# EasyEDA Pro project GD32.eprj

# Schematic GD32
Create Date: 2024-03-06; Page Name: GD32; Project Name: GD32; Schematic Name: STM32小项目; Update Date: 2024-03-07; Company: 清华大学; Drawed: 李家瑶; Page Size: A4; Reviewed: 李家瑶; Version: V1.0
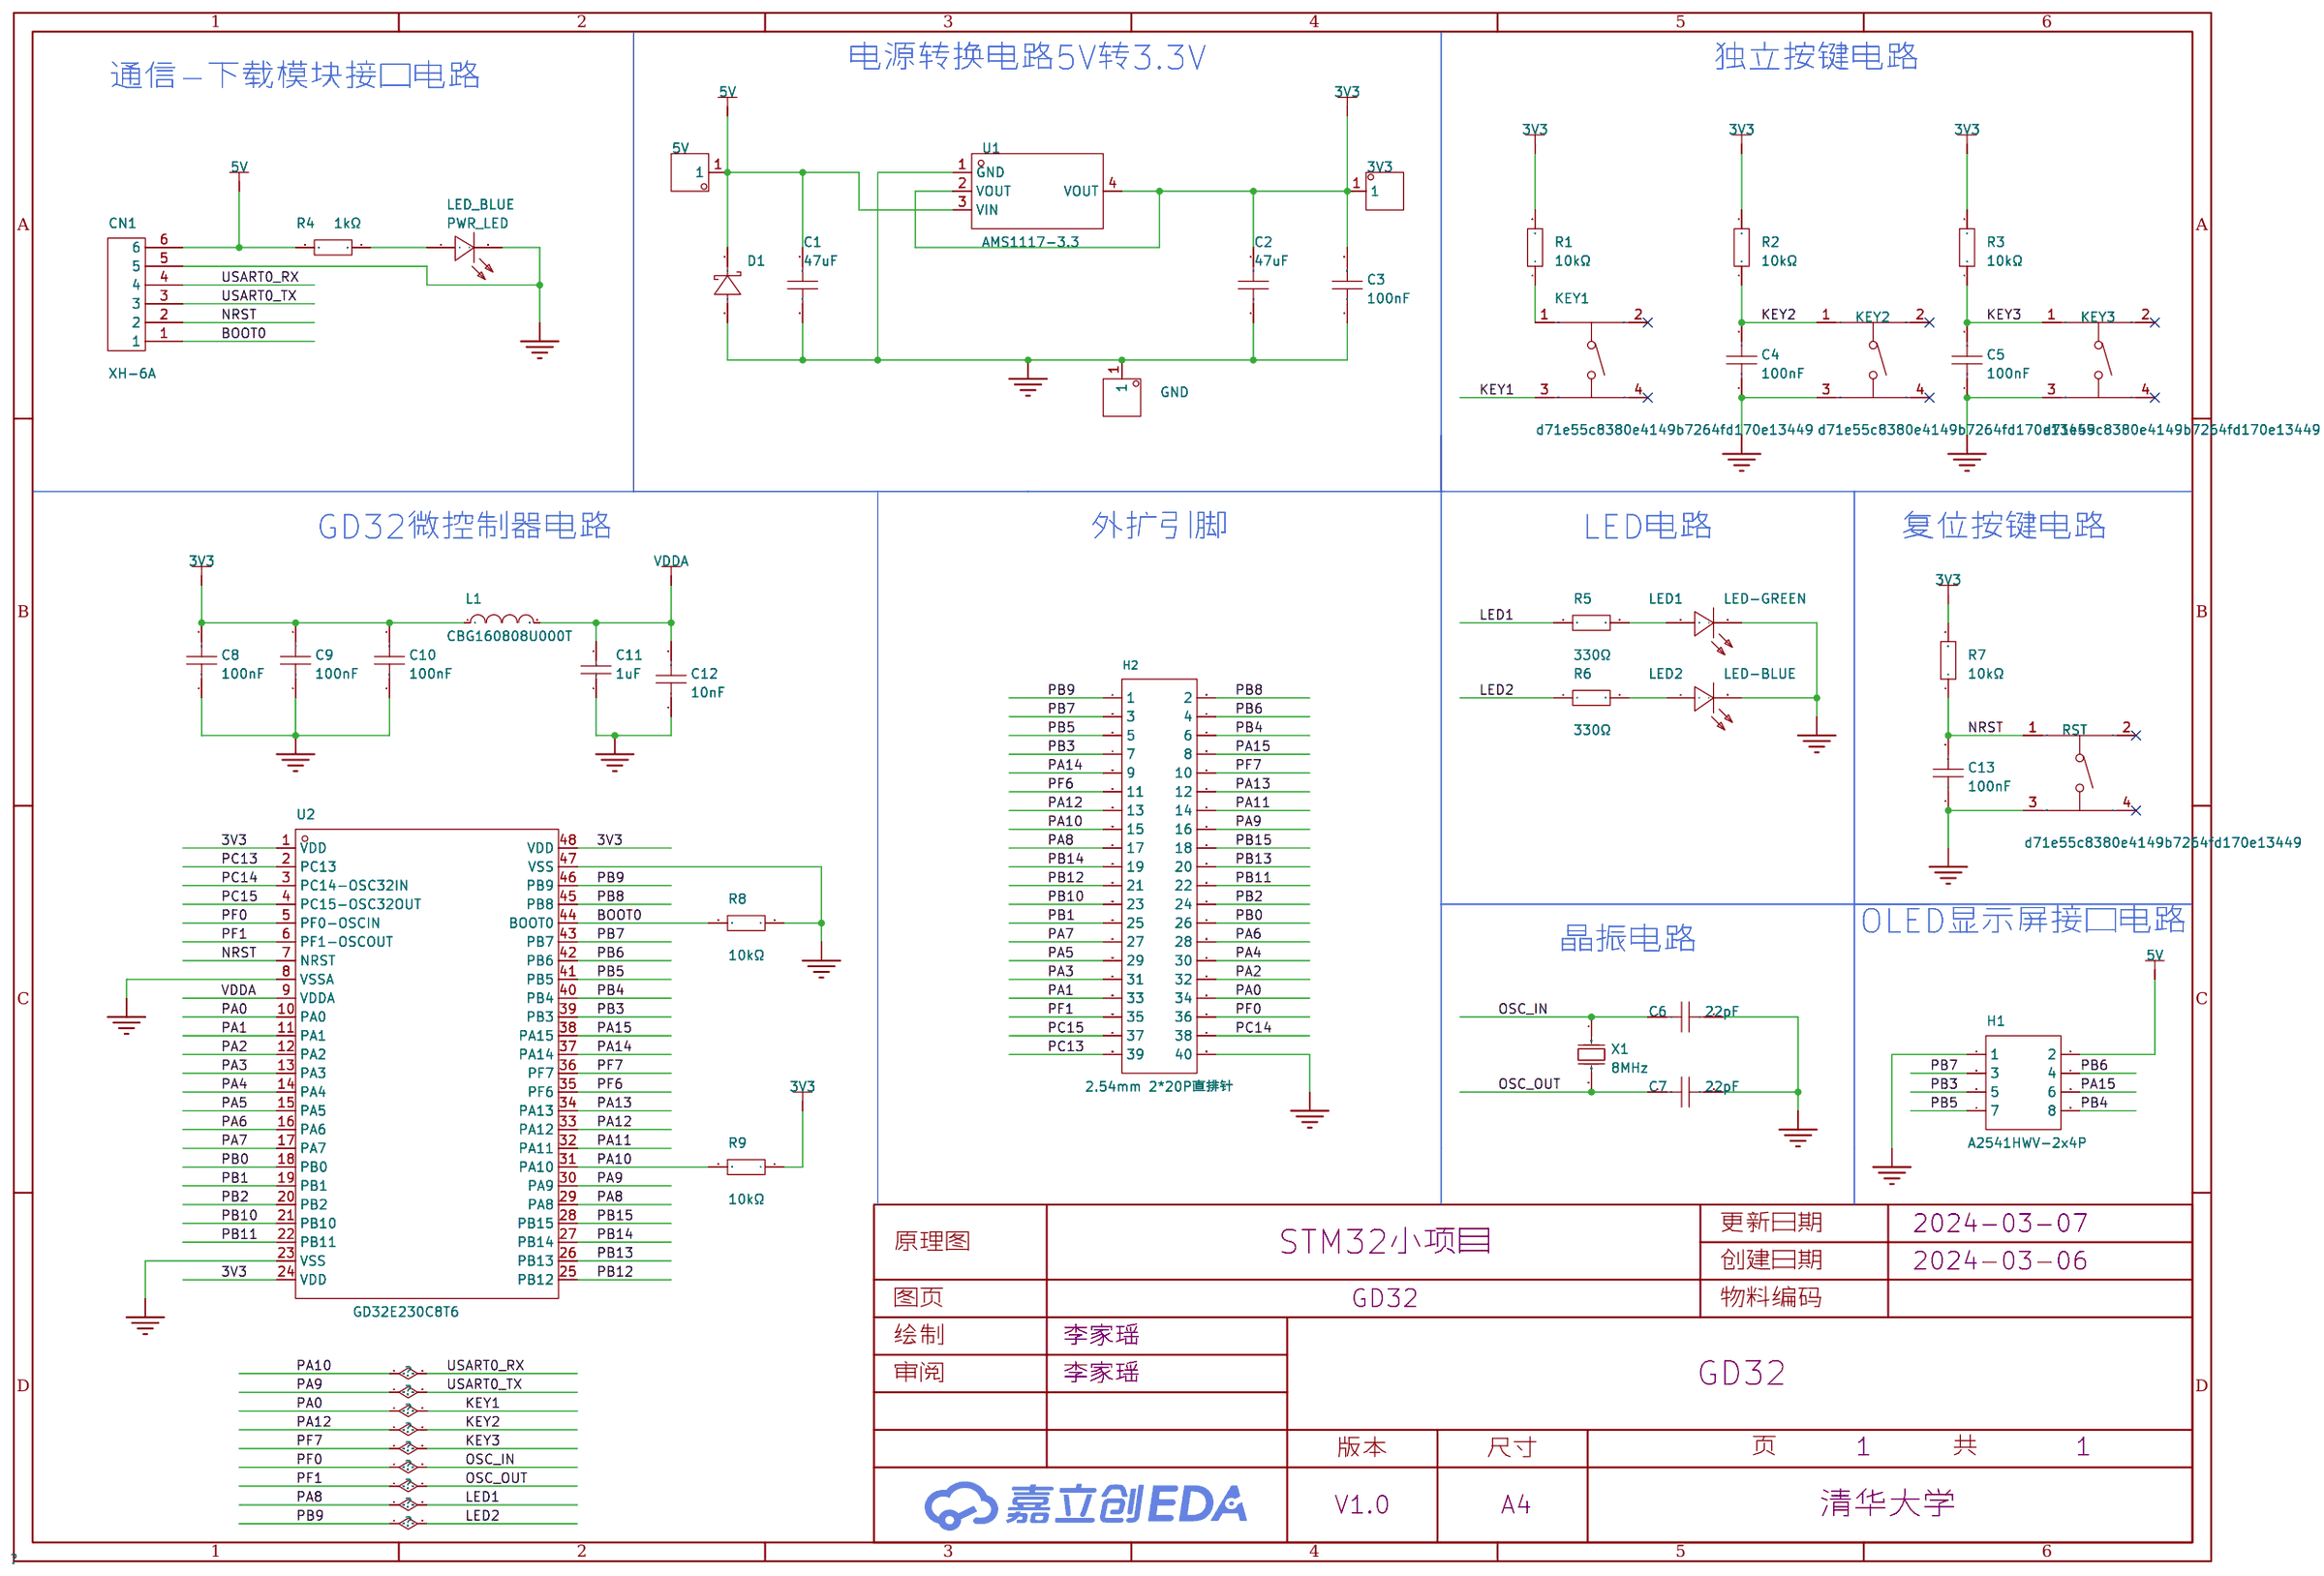
[diagram p0: schematic sheet]

## Parts
3V3  5003  [TEST-TH_BD2.54-P1.39]
5V  5003  [TEST-TH_BD2.54-P1.39]
C1  47uF  [C1206]
C2  47uF  [C1206]
C3  100nF  [C0603]
C4  100nF  [C0603]
C5  100nF  [C0603]
C6  22pF  [C0603]
C7  22pF  [C0603]
C8  100nF  [C0603]
C9  100nF  [C0603]
C10  100nF  [C0603]
C11  1uF  [C0603]
C12  10nF  [C0603]
C13  100nF  [C0603]
CN1  XH-6A  [CONN-TH_6P-P2.50_XH-6A]
D1  SMAJ5.0A  [SMA_L4.3-W2.6-LS5.0-RD]
GND  5003  [TEST-TH_BD2.54-P1.39]
H1  A2541HWV-2x4P  [HDR-TH_8P-P2.54-V-F-R2-C4-S2.54-1]
H2  2.54mm 2*20P直排针  [HDR-TH_40P-P2.54-V-M-R2-C20-S2.54]
KEY1  d71e55c8380e4149b7264fd170e13449  [SW-TH_4P-L6.0-W6.0-P4.50-LS6.5]
KEY2  d71e55c8380e4149b7264fd170e13449  [SW-TH_4P-L6.0-W6.0-P4.50-LS6.5]
KEY3  d71e55c8380e4149b7264fd170e13449  [SW-TH_4P-L6.0-W6.0-P4.50-LS6.5]
L1  CBG160808U000T  [L0603]
LED1  LED-GREEN  [LED0805-R-RD]
LED2  LED-BLUE  [LED0805-R-RD]
PWR_LED  LED_BLUE  [LED0805-R-RD]
R1  10kΩ  [R0603]
R2  10kΩ  [R0603]
R3  10kΩ  [R0603]
R4  1kΩ  [R0603]
R5  330Ω  [R0603]
R6  330Ω  [R0603]
R7  10kΩ  [R0603]
R8  10kΩ  [R0603]
R9  10kΩ  [R0603]
RST  d71e55c8380e4149b7264fd170e13449  [SW-TH_4P-L6.0-W6.0-P4.50-LS6.5]
U1  AMS1117-3.3  [SOT-223-3_L6.5-W3.4-P2.30-LS7.0-BR]
U2  GD32E230C8T6  [LQFP-48_L7.0-W7.0-P0.50-LS9.0-BL]
X1  8MHz  [CRYSTAL-SMD_L11.5-W4.8-LS12.7]

## Library data of the parts
3V3 5V GND = 5003: 类型:测试环;全长/全高:7.62mm;工作高度:-;接触电阻:-;弹性寿命:-;额定电流:-;额定电压:-;触头材质:磷青铜;触头镀层:-;工作温度范围:-;; Supplier Part: C238124; Manufacturer: Keystone; Datasheet: https://atta.szlcsc.com/upload/public/pdf/source/20211115/64B944F8418AA2CF0680BB1B201435FB.pdf; Supplier: LCSC; Type: 测试环; Overall Length/Height: 7.62mm; Contact Material: 磷青铜
C1 C2 = GRM31CR61C476ME44L: 容值:47uF;精度:±20%;额定电压:16V;材质(温度系数):X5R;; LCSC Part Name: 47uF ±20% 16V; Supplier Part: C385047; Manufacturer: muRata(村田); Supplier Footprint: 1206; Datasheet: https://atta.szlcsc.com/upload/public/pdf/source/20200305/C490387_23319AE8C154DEB24C505E6C82A8106A.pdf; Supplier: LCSC; Tolerance: ±20%; Voltage Rated: 16V; Temperature Coefficient: X5R
C3-C5 C8-C10 C13 = CC0603KRX7R9BB104: 容值:100nF;精度:±10%;额定电压:50V;材质(温度系数):X7R;; LCSC Part Name: 100nF ±10% 50V; Supplier Part: C14663; Manufacturer: YAGEO(国巨); Supplier Footprint: 0603; Datasheet: https://atta.szlcsc.com/upload/public/pdf/source/20180910/C282072_33301C7F631E79921B82A8DAC6BCC5B3.pdf; Supplier: LCSC; Tolerance: ±10%; Voltage Rated: 50V; Temperature Coefficient: X7R
C6 C7 = 0603CG220J500NT: 容值:22pF;精度:±5%;额定电压:50V;材质(温度系数):C0G;; LCSC Part Name: 22pF ±5% 50V; Supplier Part: C91701; Manufacturer: FH(风华); Supplier Footprint: 0603; Datasheet: https://atta.szlcsc.com/upload/public/pdf/source/20200305/C486355_26A10D38EF8C2A5C37091D0039909270.pdf; Supplier: LCSC; Tolerance: ±5%; Voltage Rated: 50V; Temperature Coefficient: C0G
C11 = CC0603KRX5R8BB105: 容值:1uF;精度:±10%;额定电压:25V;材质(温度系数):X5R;; LCSC Part Name: 1uF ±10% 25V; Supplier Part: C14664; Manufacturer: YAGEO(国巨); Supplier Footprint: 0603; Datasheet: https://atta.szlcsc.com/upload/public/pdf/source/20160606/1465200209684.pdf; Supplier: LCSC; Tolerance: ±10%; Voltage Rated: 25V; Temperature Coefficient: X5R
C12 = AC0603KRX7R9BB103: 容值:10nF;精度:±10%;额定电压:50V;材质(温度系数):X7R;; LCSC Part Name: 10nF ±10% 50V; Supplier Part: C149618; Manufacturer: YAGEO(国巨); Supplier Footprint: 0603; Datasheet: https://atta.szlcsc.com/upload/public/pdf/source/20180620/C149620_02F8B13B41E85E9B7C614DEEBBCCF362.pdf; Supplier: LCSC; Tolerance: ±10%; Voltage Rated: 50V; Temperature Coefficient: X7R
CN1 = XH-6A_C5663: 插针结构:1x6P;间距:2.5mm;安装方式:-;参考系列:XH;总PIN数:6P;排数:1;每排PIN数:6;行距:-;触头材质:-;; LCSC Part Name: 系列:XH 间距:2.5mm 1x6P; Supplier Part: C5663; Manufacturer: BOOMELE(博穆精密); Supplier Footprint: 插件,P=2.5mm; Datasheet: https://atta.szlcsc.com/upload/public/pdf/source/20151222/1457707654251.pdf; Supplier: LCSC; Pins Structure: 1x6P; Pitch: 2.5mm; Reference Series: XH; Number of Pins: 6P; Number of Rows: 1; Number of PINs Per Row: 6
D1 = SMAJ5.0A_C2925443: 反向截止电压(Vrwm):5V;最大钳位电压:9.2V;峰值脉冲电流(Ipp)@10/1000us:43.5A;峰值脉冲功率(Ppp)@10/1000us:400W;击穿电压:6.4V;; LCSC Part Name: 单向TVS 5V截止 43.5A峰值脉冲; Supplier Part: C2925443; Manufacturer: Liown(里阳半导体); Supplier Footprint: SMA(DO-214AC); Datasheet: https://atta.szlcsc.com/upload/public/pdf/source/20231227/25A83E67FF645F691E07E37C0DAD86D4.pdf; Supplier: LCSC; Reverse Stand-Off Voltage (Vrwm): 5V; Maximum Clamping Voltage: 9.2V; Peak Pulse Current (Ipp)@10/1000us: 43.5A; Peak Pulse Power Dissipation (Ppp)@10/1000us: 400W; Breakdown Voltage: 6.4V; Reverse Leakage Current (Ir): 800uA; Type: TVS
H1 = A2541HWV-2x4P: 插孔结构:2x4P;间距:2.54mm;行距:2.54mm;安装类型:直插;排数:双排;总孔位数:8P;塑高:-;触头材质:黄铜;触头镀层:金;; LCSC Part Name: 间距:2.54mm 2x4P 直插; Supplier Part: C239344; Manufacturer: CJT(长江连接器); Supplier Footprint: 插件,P=2.54mm; Datasheet: https://atta.szlcsc.com/upload/public/pdf/source/20180724/C239359_48B1BC0CA1B4E4396A63955AAFD15564.pdf; Supplier: LCSC; Holes Structure: 2x4P; Pitch: 2.54mm; Row Spacing: 2.54mm; Mounting Type: 直插; Number of Rows: 双排; Number of Holes: 8P; Contact Material: 黄铜; Contact Plating: 金
H2 = 2.54mm 2*20P直排针: 插针结构:2x20P;间距:2.54mm;行距:2.54mm;圆针/方针:方针;安装类型:直插;排数:双排;总PIN位数:40P;额定电流:3A;额定电压:-;配合针长度:6mm;塑高:-;端接针长度:3mm;触头材质:黄铜;触头镀层:-;工作温度范围:-40℃~+105℃;颜色:黑色;; LCSC Part Name: 间距:2.54mm 2x20P 直插 方针; Supplier Part: C50980; Manufacturer: BOOMELE(博穆精密); Supplier Footprint: 插件,P=2.54mm; Datasheet: https://atta.szlcsc.com/upload/public/pdf/source/20151109/1457707572823.pdf; Supplier: LCSC; Pin Structure: 2x20P; Pitch: 2.54mm; Row Spacing: 2.54mm; Circluar Pins/Square Pins: 方针; Mounting Type: 直插; Number of Rows: 双排; Number of Pins: 40P; Current Rating (Max): 3A; Length of Mating Pin: 6mm; Length of End Connection Pin: 3mm; Contact Material: 黄铜; Operating Temperature Range: -40℃~+105℃; Color: 黑色
KEY1-KEY3 RST = TS-1095-A5B2-D1: 电路结构:单刀单掷;按钮形状:圆形按钮;作用力:180gf;安装方式:直插;开关长度:6mm;开关宽度:6mm;开关高度:6mm;带支架:不带;机械寿命:-;; LCSC Part Name: 6*6*6mm 直插 轻触开关; Supplier Part: C782808; Manufacturer: Yuandi(元迪); Supplier Footprint: 插件; Datasheet: https://atta.szlcsc.com/upload/public/pdf/source/20200908/C782804_D14F61DCCBE05C7EE913124CF28857B3.pdf; Supplier: LCSC; Circuit: 单刀单掷; Actuator Style: 圆形按钮; Operating Force: 180gf; Mounting Style: 直插; Switch Length: 6mm; Switch Width: 6mm; Switch Height: 6mm; Strike Gundam: 不带; Actuator/Cap Color: 黑色; Pin Style: PC引脚
L1 = CBG160808U000T: 标称阻抗@测试频率:0Ω@100MHz;直流电阻(RDC):100mΩ;; LCSC Part Name: 单路 0603磁珠 阻抗0Ω@100MHz; Supplier Part: C43163; Manufacturer: FH(风华); Supplier Footprint: 0603; Datasheet: https://atta.szlcsc.com/upload/public/pdf/source/20190129/C361667_1614D407CC98D1D3CFBD9E1F7511C14D.pdf; Supplier: LCSC; Impedance @ Frequency: 0Ω@100MHz; DC Resistance: 100mΩ; Current Rating: 800mA; Circuits: 1
LED1 LED2 PWR_LED = NCD0805B2: 发光颜色:蓝色;正向电压(VF):2.5V~3.6V;功率:72mW;正向电流:2mA;主波长:468nm~478nm;透镜颜色:无色透明透镜;发光强度:20mcd~55mcd;发光角度:130°;工作温度:-30℃~+85℃;; Supplier Part: C84259; Manufacturer: 国星光电; Supplier Footprint: 0805; Datasheet: https://atta.szlcsc.com/upload/public/pdf/source/20200820/C84259_E5AC6865415989C4C2C2831134BA3A23.pdf; Supplier: LCSC; Emitted Color: 蓝色; Forward Voltage (VF): 2.5V~3.6V; Power Dissipation: 72mW; Forward Current: 2mA; Dominant Wavelength: 468nm~478nm; Lens Color: 无色透明透镜; Luminous Intensity: 20mcd~55mcd; Viewing Angle: 130°; Operating Temperature: -30℃~+85℃
R1-R3 R7-R9 = 0603WAF1002T5E: 电阻类型:厚膜电阻;阻值:10kΩ;精度:±1%;功率:100mW;最大工作电压:75V;温度系数:±100ppm/℃;; LCSC Part Name: 厚膜电阻 10kΩ ±1% 100mW; Supplier Part: C25804; Manufacturer: UNI-ROYAL(厚声); Supplier Footprint: 0603; Datasheet: https://atta.szlcsc.com/upload/public/pdf/source/20200306/C422600_1E6D84923E4A46A82E41ADD87F860B5C.pdf; Supplier: LCSC; Type: 厚膜电阻; Tolerance: ±1%; Power(Watts): 100mW; Overload Voltage (Max): 75V; Temperature Coefficient: ±100ppm/℃; Operating Temperature Range: -55℃~+155℃
R4 = 0603WAF1001T5E: 电阻类型:厚膜电阻;阻值:1kΩ;精度:±1%;功率:100mW;最大工作电压:75V;温度系数:±100ppm/℃;; LCSC Part Name: 1kΩ ±1% 100mW 厚膜电阻; Supplier Part: C21190; Manufacturer: UNI-ROYAL(厚声); Supplier Footprint: 0603; Datasheet: https://atta.szlcsc.com/upload/public/pdf/source/20200306/C422600_1E6D84923E4A46A82E41ADD87F860B5C.pdf; Supplier: LCSC; Type: 厚膜电阻; Tolerance: ±1%; Power(Watts): 100mW; Overload Voltage (Max): 75V; Temperature Coefficient: ±100ppm/℃; Operating Temperature Range: -55℃~+155℃
R5 R6 = 0603WAF3300T5E: 电阻类型:厚膜电阻;阻值:330Ω;精度:±1%;功率:100mW;最大工作电压:75V;温度系数:±100ppm/℃;; LCSC Part Name: 330Ω ±1% 100mW 厚膜电阻; Supplier Part: C23138; Manufacturer: UNI-ROYAL(厚声); Supplier Footprint: 0603; Datasheet: https://atta.szlcsc.com/upload/public/pdf/source/20200306/C422600_1E6D84923E4A46A82E41ADD87F860B5C.pdf; Supplier: LCSC; Type: 厚膜电阻; Tolerance: ±1%; Power(Watts): 100mW; Overload Voltage (Max): 75V; Temperature Coefficient: ±100ppm/℃; Operating Temperature Range: -55℃~+155℃
U1 = AMS1117-3.3_C6186: 输出类型:固定;最大输入电压:-;输出电压:3.3V;最大输出电流:1A;电源纹波抑制比(PSRR):72dB@(120Hz);输出极性:正极;; LCSC Part Name: 输出3.3V 1A; Supplier Part: C6186; Manufacturer: AMS; Supplier Footprint: SOT-223-3; Datasheet: https://atta.szlcsc.com/upload/public/pdf/source/20180727/C6186_7A095716F0823C02F1997A905E26C086.pdf; Supplier: LCSC; Output Type: 固定; Output Voltage: 3.3V; MAX Output Current: 1A; Power Supply Rejection Ratio (PSRR): 72dB@(120Hz); Dropout Voltage: 1.3V@(800mA); Output Polarity: 正极; Number of Outputs: 1
U2 = GD32E230C8T6: CPU内核:ARM-M系列;程序存储容量:64KB;RAM总容量:8KB;GPIO端口数量:39;工作电压范围:1.8V~3.6V;CPU最大主频:72MHz;程序存储器类型:FLASH;; Supplier Part: C380535; Manufacturer: GigaDevice(兆易创新); Supplier Footprint: LQFP-48(7x7); Datasheet: https://atta.szlcsc.com/upload/public/pdf/source/20190430/C380536_2D19A74EFFA80713F81C6AB288AA8E06.pdf; Supplier: LCSC; CPU Core: ARM-M系列; Program Storage Size: 64KB; RAM Size: 8KB; GPIO Ports Number: 39; Operating Voltage Range: 1.8V~3.6V; CPU Maximum Speed: 72MHz; Program Memory Type: FLASH; Operating Temperature Range: -40℃~+85℃; ADC (Bit): 12bit; PWM (Bit): 16bit; 16Bit Timer: 6; UART/USART: 2; I2C: 2; SPI: 2; Internal Comparator: 有; Peripheral/Function: 片载温度传感器；DMA；看门狗；LIN总线协议；PWM；IrDA；RTC实时时钟; Watchdog: 有; Real-Time Clock: 有; Infrared Data Association: 有; Direct Memory Access: 有; Internal Oscillator: 有
X1 = X49SM8MSD2SC: 晶振类型:贴片晶振;频率:8MHz;常温频差:±20ppm;外接负载电容:20pF;频率稳定度(全温):±30ppm;; LCSC Part Name: 8MHz ±20ppm 20pF; Supplier Part: C12674; Manufacturer: YXC(扬兴晶振); Supplier Footprint: HC-49S-SMD; Datasheet: https://atta.szlcsc.com/upload/public/pdf/source/20210329/C106809_0E91E60850A780B284B63D653DC40EA4.pdf; Supplier: LCSC; Crystal Type: 贴片晶振; Normal temperature Frequency Tolerance: ±20ppm; External load capacitor: 20pF; Frequency Stability(Full temperature range): ±30ppm; Operating Temperature: -20℃~+70℃

## Nets
3V3: 3V3.1 C2.2 C3.2 C8.2 C9.2 C10.2 L1.1 R1.2 R2.2 R3.2 R7.2 R9.1 U1.2(VOUT) U1.4(VOUT) U2.1(VDD) U2.24(VDD) U2.48(VDD)
5V: 5V.1 C1.2 CN1.6 D1.1(K) H1.2 R4.1 U1.3(VIN)
GND: C1.1 C2.1 C3.1 C4.1 C5.1 C6.2 C7.2 C8.1 C9.1 C10.1 C11.1 C12.1 C13.1 CN1.5 D1.2(A) GND.1 H1.1 H2.40 KEY2.3 KEY3.3 LED1.2(-) LED2.2(-) PWR_LED.2(-) R8.1 RST.3 U1.1(GND) U2.8(VSSA) U2.23(VSS) U2.47(VSS)
VDDA: C11.2 C12.2 L1.2 U2.9(VDDA)
BOOT0: CN1.1 R8.2 U2.44(BOOT0)
KEY1: H2.34 KEY1.3 U2.10(PA0)
KEY2: C4.2 H2.13 KEY2.1 R2.1 U2.33(PA12)
KEY3: C5.2 H2.10 KEY3.1 R3.1 U2.36(PF7)
LED1: H2.17 R5.1 U2.29(PA8)
LED2: H2.1 R6.1 U2.46(PB9)
NRST: C13.2 CN1.2 R7.1 RST.1 U2.7(NRST)
OSC_IN: C6.1 H2.36 U2.5(PF0-OSCIN) X1.1(OSC1)
OSC_OUT: C7.1 H2.35 U2.6(PF1-OSCOUT) X1.2(OSC2)
PA1: H2.33 U2.11(PA1)
PA2: H2.32 U2.12(PA2)
PA3: H2.31 U2.13(PA3)
PA4: H2.30 U2.14(PA4)
PA5: H2.29 U2.15(PA5)
PA6: H2.28 U2.16(PA6)
PA7: H2.27 U2.17(PA7)
PA9: CN1.3 H2.16 U2.30(PA9)
PA10: CN1.4 H2.15 R9.2 U2.31(PA10)
PA11: H2.14 U2.32(PA11)
PA13: H2.12 U2.34(PA13)
PA14: H2.9 U2.37(PA14)
PA15: H1.6 H2.8 U2.38(PA15)
PB0: H2.26 U2.18(PB0)
PB1: H2.25 U2.19(PB1)
PB2: H2.24 U2.20(PB2)
PB3: H1.5 H2.7 U2.39(PB3)
PB4: H1.8 H2.6 U2.40(PB4)
PB5: H1.7 H2.5 U2.41(PB5)
PB6: H1.4 H2.4 U2.42(PB6)
PB7: H1.3 H2.3 U2.43(PB7)
PB8: H2.2 U2.45(PB8)
PB10: H2.23 U2.21(PB10)
PB11: H2.22 U2.22(PB11)
PB12: H2.21 U2.25(PB12)
PB13: H2.20 U2.26(PB13)
PB14: H2.19 U2.27(PB14)
PB15: H2.18 U2.28(PB15)
PC13: H2.39 U2.2(PC13)
PC14: H2.38 U2.3(PC14-OSC32IN)
PC15: H2.37 U2.4(PC15-OSC32OUT)
PF6: H2.11 U2.35(PF6)
$1N1197: PWR_LED.1(+) R4.2
$1N1482: KEY1.1 R1.1
$1N2236: LED1.1(+) R5.2
$1N2239: LED2.1(+) R6.2

Not connected (* = marked no-connect by the designer): KEY1 2* 4*; KEY2 2* 4*; KEY3 2* 4*; RST 2* 4*

## Notes on the sheet
- 电源转换电路5V转3.3V
- 独立按键电路
- 通信-下载模块接口电路
- GD32微控制器电路
- 外扩引脚
- LED电路
- 复位按键电路
- OLED显示屏接口电路
- 晶振电路

# Board GD32
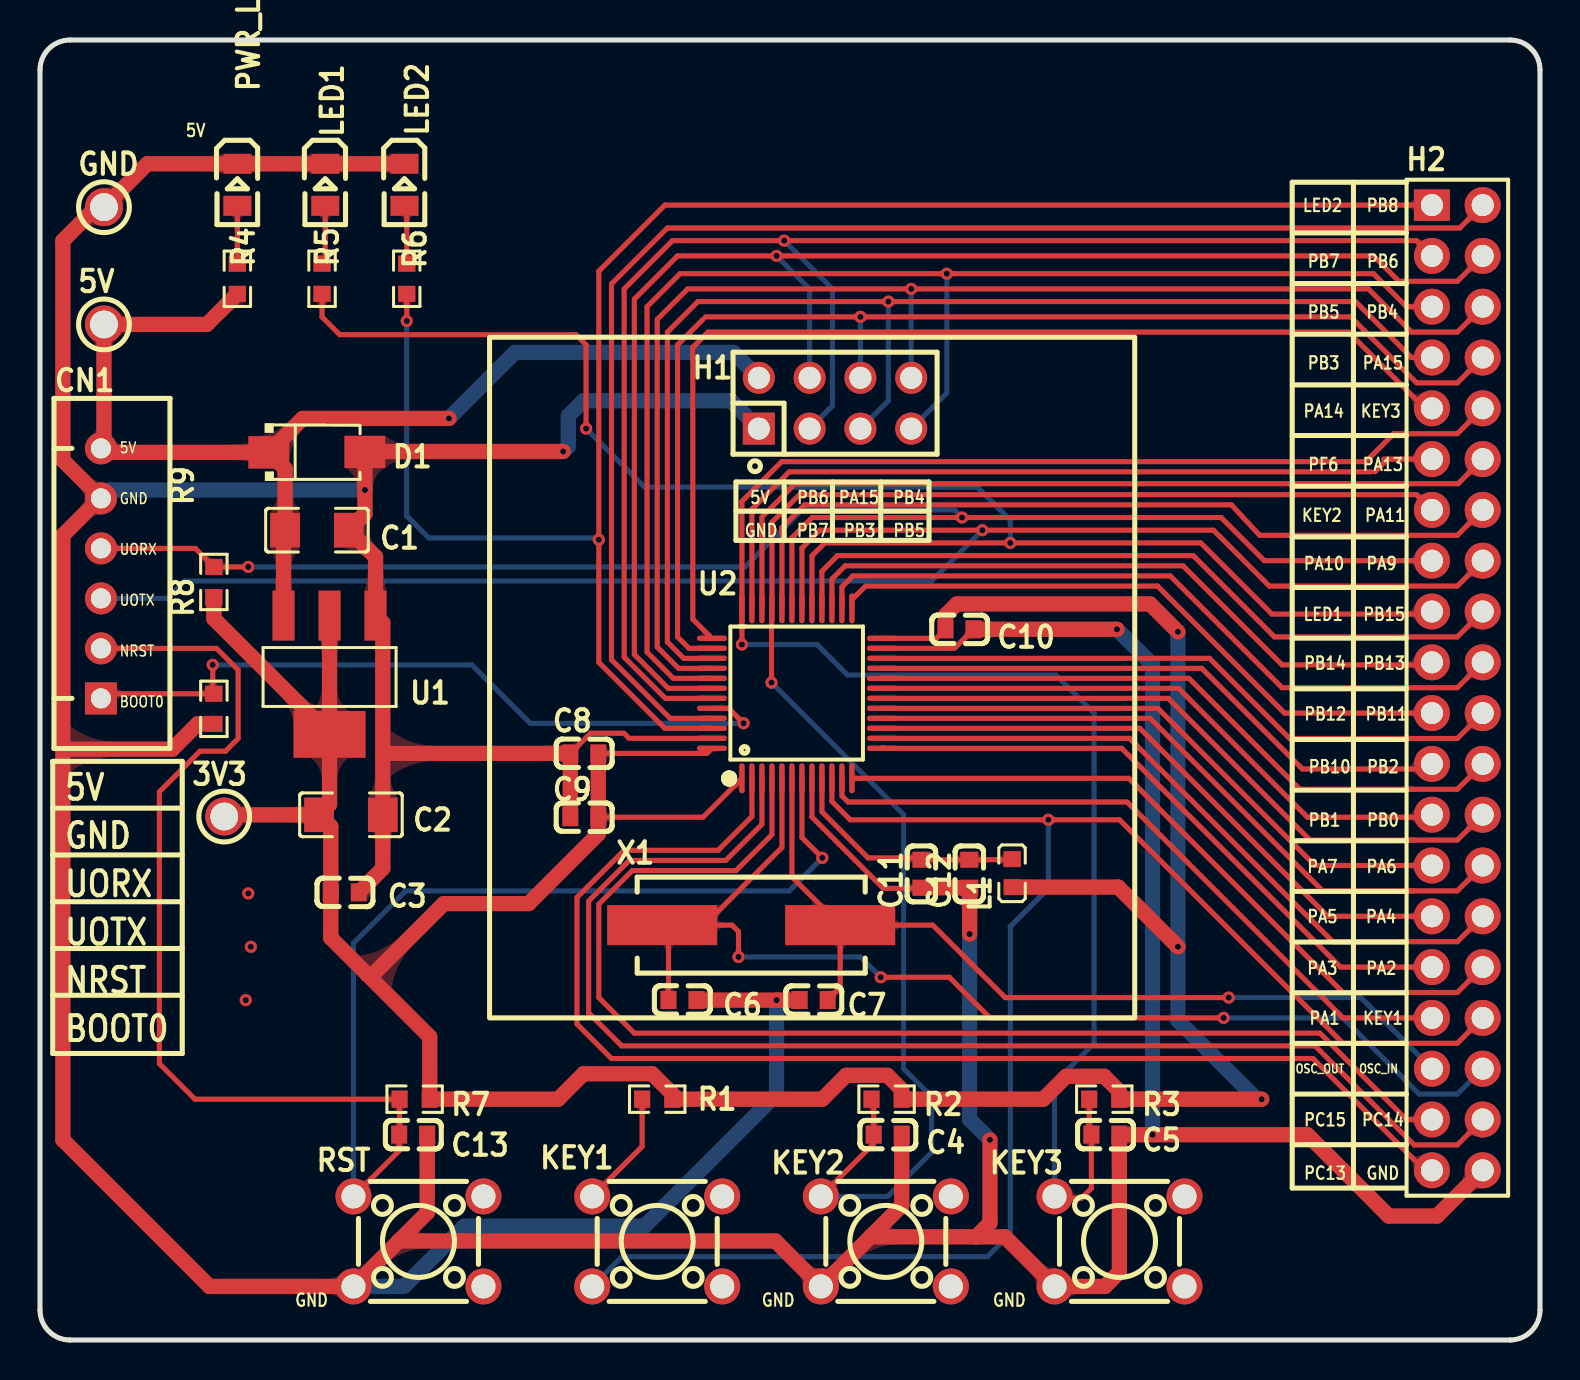
[diagram p1: board, top side]
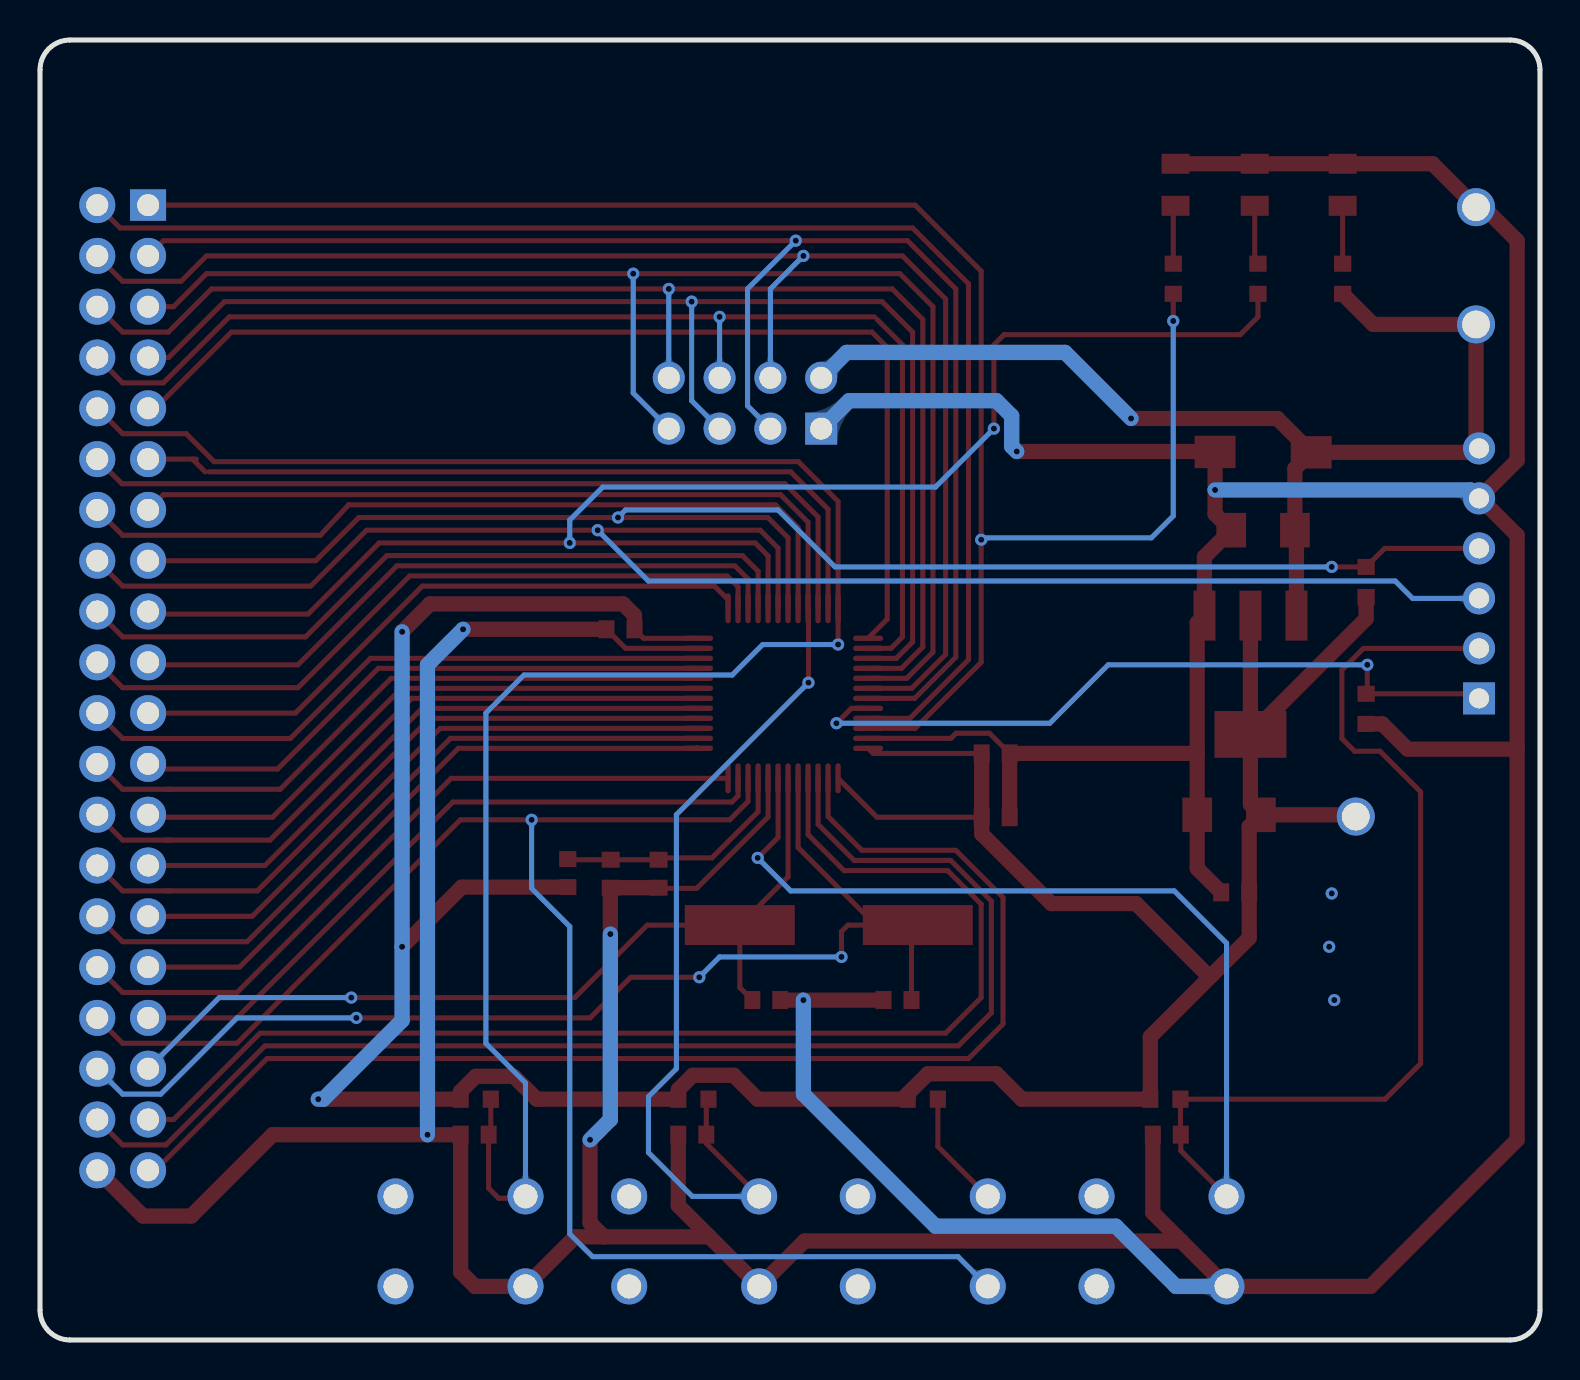
[diagram p2: board, bottom side, seen from below]

Outline 75 x 65 mm; copper layers: Top Layer, Bottom Layer. Coordinates in mm from the lower left corner of the outline.
Outline path: 0,63.5 0,1.5 arc(0.44,0.44) 1.5,0 73.5,0 arc(74.56,0.44) 75,1.5 75,63.5 arc(74.56,64.56) 73.5,65 1.5,65 arc(0.44,64.56) 0,63.5
Stack: Top Layer 0.035mm / Dielectric1 1.51mm FR4 er 4.5 / Bottom Layer 0.035mm

## Design rules (mm)
template: 自定义配置
spacing copperThickness2oz: track to track 0.203, other pairs 0.152 to 0.3
spacing safeClearance (default): track to track 0.203, other pairs 0.203 to 0.203
track width copperThickness2oz: min 0.203, default 0.254, max 2.54
track width trackWidth (default): min 0.254, default 0.254, max 0.762
track width VCC and GND: min 0.254, default 0.762, max 0.762
differential pair differentialPair (default): width min 0.127, default 0.254, max 2.54; gap min 0.152, default 0.152
via viaSize (default): diameter min 0.5, default 0.61, max 10; hole min 0.3, default 0.305, max 6.299
net GND uses VCC and GND
net 5V uses VCC and GND
net 3V3 uses VCC and GND

## Placement (name value [footprint] x y rotation side)
3V3  5003  [TEST-TH_BD2.54-P1.39]  9.21 26.17 0 top
5V  5003  [TEST-TH_BD2.54-P1.39]  3.2 50.78 0 top
C1  47uF  [C1206]  13.85 40.49 180 top
C2  47uF  [C1206]  15.55 26.26 180 top
C3  100nF  [C0603]  15.24 22.38 180 top
C4  100nF  [C0603]  42.38 10.27 180 top
C5  100nF  [C0603]  53.27 10.27 180 top
C6  22pF  [C0603]  32.12 17 0 top
C7  22pF  [C0603]  38.68 17 180 top
C8  100nF  [C0603]  27.22 29.33 0 top
C9  100nF  [C0603]  27.22 26.14 0 top
C10  100nF  [C0603]  45.97 35.54 180 top
C11  1uF  [C0603]  44.07 23.31 90 top
C12  10nF  [C0603]  46.47 23.31 90 top
C13  100nF  [C0603]  18.66 10.27 180 top
CN1  XH-6A  [CONN-TH_6P-P2.50_XH-6A]  3.05 38.33 90 top
D1  SMAJ5.0A  [SMA_L4.3-W2.6-LS5.0-RD]  13.84 44.39 0 top
GND  5003  [TEST-TH_BD2.54-P1.39]  3.2 56.64 0 top
H1  A2541HWV-2x4P  [HDR-TH_8P-P2.54-V-F-R2-C4-S2.54-1]  39.75 46.84 0 top
H2  2.54mm 2*20P直排针  [HDR-TH_40P-P2.54-V-M-R2-C20-S2.54]  70.87 32.61 270 top
KEY1  d71e55c8380e4149b7264fd170e13449  [SW-TH_4P-L6.0-W6.0-P4.50-LS6.5]  30.86 4.93 0 top
KEY2  d71e55c8380e4149b7264fd170e13449  [SW-TH_4P-L6.0-W6.0-P4.50-LS6.5]  42.29 4.93 0 top
KEY3  d71e55c8380e4149b7264fd170e13449  [SW-TH_4P-L6.0-W6.0-P4.50-LS6.5]  53.97 4.93 0 top
L1  CBG160808U000T  [L0603]  48.61 23.34 90 top
LED1  LED-GREEN  [LED0805-R-RD]  14.26 57.76 270 top
LED2  LED-BLUE  [LED0805-R-RD]  18.22 57.76 270 top
PWR_LED  LED_BLUE  [LED0805-R-RD]  9.87 57.76 270 top
R1  10kΩ  [R0603]  30.86 12.04 0 top
R2  10kΩ  [R0603]  42.33 12.04 0 top
R3  10kΩ  [R0603]  53.21 12.04 0 top
R4  1kΩ  [R0603]  9.87 53.06 90 top
R5  330Ω  [R0603]  14.1 53.06 90 top
R6  330Ω  [R0603]  18.34 53.06 90 top
R7  10kΩ  [R0603]  18.73 12.04 0 top
R8  10kΩ  [R0603]  8.69 31.56 90 top
R9  10kΩ  [R0603]  8.69 37.9 90 top
RST  d71e55c8380e4149b7264fd170e13449  [SW-TH_4P-L6.0-W6.0-P4.50-LS6.5]  18.92 4.93 0 top
U1  AMS1117-3.3  [SOT-223-3_L6.5-W3.4-P2.30-LS7.0-BR]  14.48 33.25 90 top
U2  GD32E230C8T6  [LQFP-48_L7.0-W7.0-P0.50-LS9.0-BL]  37.85 32.33 0 top
X1  8MHz  [CRYSTAL-SMD_L11.5-W4.8-LS12.7]  35.56 20.74 0 top

## Footprints (pads in the part's own frame, mm; a bottom-side part is the same pattern mirrored in y, then rotated)
C0603
  rect 0.8x0.9 smd: 1(-0.7,0) 2(0.7,0)
C1206
  rect 1.485x1.728 smd: 1(-1.593,0) 2(1.593,0)
CONN-TH_6P-P2.50_XH-6A
  rect 1.6x1.6 hole 1: 1(-6.25,0)
  round 1.6 hole 1: 2(-3.75,0) 3(-1.25,0) 4(1.25,0) 5(3.75,0) 6(6.25,0)
CRYSTAL-SMD_L11.5-W4.8-LS12.7
  rect 5.5x2 smd: 1(-4.45,0) 2(4.45,0)
HDR-TH_8P-P2.54-V-F-R2-C4-S2.54-1
  rect 1.6x1.6 hole 1.1: 1(-3.81,-1.27)
  round 1.6 hole 1.1: 2(-3.81,1.27) 3(-1.27,-1.27) 4(-1.27,1.27) 5(1.27,-1.27) 6(1.27,1.27) 7(3.81,-1.27) 8(3.81,1.27)
HDR-TH_40P-P2.54-V-M-R2-C20-S2.54
  rect 1.575x1.8 hole 1.1: 1(-24.13,-1.27)
  round 1.8 hole 1.1: 2(-24.13,1.27) 3(-21.59,-1.27) 4(-21.59,1.27) 5(-19.05,-1.27) 6(-19.05,1.27) 7(-16.51,-1.27) 8(-16.51,1.27) 9(-13.97,-1.27) 10(-13.97,1.27) 11(-11.43,-1.27) 12(-11.43,1.27) 13(-8.89,-1.27) 14(-8.89,1.27) 15(-6.35,-1.27) 16(-6.35,1.27) 17(-3.81,-1.27) 18(-3.81,1.27) 19(-1.27,-1.27) 20(-1.27,1.27) 21(1.27,-1.27) 22(1.27,1.27) 23(3.81,-1.27) 24(3.81,1.27) 25(6.35,-1.27) 26(6.35,1.27) 27(8.89,-1.27) 28(8.89,1.27) 29(11.43,-1.27) 30(11.43,1.27) 31(13.97,-1.27) 32(13.97,1.27) 33(16.51,-1.27) 34(16.51,1.27) 35(19.05,-1.27) 36(19.05,1.27) 37(21.59,-1.27) 38(21.59,1.27) 39(24.13,-1.27) 40(24.13,1.27)
L0603
  rect 0.8x0.864 smd: 1(-0.7,0) 2(0.7,0)
LED0805-R-RD
  rect 1x1.399 smd: 1(1.05,0) 2(-1.05,0)
LQFP-48_L7.0-W7.0-P0.50-LS9.0-BL
  oval 0.27x1.5 smd: 1(-2.75,-4.25) 2(-2.25,-4.25) 3(-1.75,-4.25) 4(-1.25,-4.25) 5(-0.75,-4.25) 6(-0.25,-4.25) 7(0.25,-4.25) 8(0.75,-4.25) 9(1.25,-4.25) 10(1.75,-4.25) 11(2.25,-4.25) 12(2.75,-4.25) 25(2.75,4.25) 26(2.25,4.25) 27(1.75,4.25) 28(1.25,4.25) 29(0.75,4.25) 30(0.25,4.25) 31(-0.25,4.25) 32(-0.75,4.25) 33(-1.25,4.25) 34(-1.75,4.25) 35(-2.25,4.25) 36(-2.75,4.25)
  oval 1.5x0.27 smd: 13(4.25,-2.75) 14(4.25,-2.25) 15(4.25,-1.75) 16(4.25,-1.25) 17(4.25,-0.75) 18(4.25,-0.25) 19(4.25,0.25) 20(4.25,0.75) 21(4.25,1.25) 22(4.25,1.75) 23(4.25,2.25) 24(4.25,2.75) 37(-4.25,2.75) 38(-4.25,2.25) 39(-4.25,1.75) 40(-4.25,1.25) 41(-4.25,0.75) 42(-4.25,0.25) 43(-4.25,-0.25) 44(-4.25,-0.75) 45(-4.25,-1.25) 46(-4.25,-1.75) 47(-4.25,-2.25) 48(-4.25,-2.75)
R0603
  rect 0.806x0.864 smd: 1(-0.753,0) 2(0.753,0)
SMA_L4.3-W2.6-LS5.0-RD
  rect 2.046x1.62 smd: 1(-2.404,-0.009) 2(2.404,0.009)
SOT-223-3_L6.5-W3.4-P2.30-LS7.0-BR
  rect 2.5x1.1 smd: 1(2.97,-2.3) 2(2.97,0) 3(2.97,2.3)
  rect 2.34x3.6 smd: 4(-2.97,0)
SW-TH_4P-L6.0-W6.0-P4.50-LS6.5
  round 1.8 hole 1.2: 1(-3.25,2.25) 2(3.25,2.25) 3(-3.25,-2.25) 4(3.25,-2.25)
TEST-TH_BD2.54-P1.39
  round 1.9 hole 1.39: 1(0,0)

## Nets
As in the schematic.

Pads without a net: KEY1 2 4; KEY2 2 4; KEY3 2 4; RST 2 4

## Via types
v1: diameter 0.61, hole 0.305, Top Layer to Bottom Layer, 37 vias

## Routing (per net, layer and track width the routed paths; a pad name or vN(x,y) marks a point on that pad's centre or on a via; arc(x,y) is an arc through that point)
3V3: length 169.5
  Top Layer w0.254: U2.1 33.15,26.14 C9.2 ; U2.24 44.82,35.08 C10.2 ; U2.48 33.34,29.33 C8.2
  Top Layer w0.762: C8.2 C9.2 27.92,25.31 24.43,21.82 20.19,21.82 16.64,18.26 16.38,18.26 ; L1.1 53.91,22.64 v1(56.9,19.66) ; U1.4 8.69,36.06 R9.1 ; U1.4 U1.2 ; U1.4 14.48,26.78 C2.2 ; 16.38,18.26 14.54,20.11 C3.2 14.54,25.67 C2.2 ; 16.38,18.26 19.49,15.16 R7.2 25.91,12.04 27.18,13.31 30.61,13.31 31.61,12.3 R1.2 39.12,12.04 40.31,13.23 42.37,13.23 43.08,12.52 R2.2 50.16,12.04 51.31,13.18 53.21,13.18 53.97,12.43 R3.2 v1(61.09,12.04) ; C2.2 9.3,26.26 3V3.1 ; v1(56.9,35.41) 55.5,36.81 45.85,36.81 45.27,36.23 C10.2
  Bottom Layer w0.762: v1(61.09,12.04) 60.83,12.04 56.9,15.98 v1(56.9,19.66) v1(56.9,35.41)
5V: length 57.7
  Top Layer w0.762: D1.1 13.13,46.08 v1(20.45,46.08) ; D1.1 12.25,43.57 C1.2 12.18,40.42 U1.3 ; D1.1 3.24,44.38 CN1.6 3.2,44.73 5V.1 8.34,50.78 R4.1
  Bottom Layer w0.762: v1(20.45,46.08) 23.75,49.38 34.67,49.38 H1.2
GND: length 354.7
  Top Layer w0.254: U2.47 29.46,30.08 29.2,30.34 27.53,30.34 26.52,29.33 ; U2.23 45.72,34.58 C10.1 ; C11.1 44.04,22.58 42.16,22.58 38.6,26.15 U2.8
  Top Layer w0.762: v1(26.16,44.43) 16.27,44.43 D1.2 v1(16.25,42.5) 16.25,41.3 C1.1 16.78,39.15 U1.1 17.14,35.86 17.14,29.32 ; 41.52,5.16 46.8,5.16 ; 41.52,5.16 KEY2.3 36.77,4.95 17.95,4.95 ; 41.52,5.16 43.09,6.72 C4.1 ; 46.8,5.16 48.25,5.16 KEY3.3 53.25,2.68 53.97,3.4 C5.1 53.97,10.26 v1(55.63,10.26) 63.37,10.26 67.44,6.2 69.85,6.2 H2.40 ; 46.8,5.16 47.5,5.85 v1(47.5,10.01) ; C10.1 v1(53.85,35.54) ; 1.14,29.54 1.14,40.23 2.99,42.08 CN1.5 1.14,43.98 1.14,54.97 2.82,56.64 GND.1 5.37,58.81 PWR_LED.2 LED1.2 LED2.2 ; 1.14,29.54 6.62,29.54 7.88,30.8 R8.1 ; 1.14,29.54 1.14,10.01 8.47,2.68 RST.3 17.95,4.95 ; 17.14,29.32 C2.1 17.14,23.58 C3.1 ; 17.14,29.32 17.15,29.33 26.52,29.33 26.52,26.14 ; 17.95,4.95 19.36,6.37 C13.1 ; C11.1 C12.1 46.48,22.6 v1(46.48,20.3) ; C7.2 37.98,16.99 v1(36.83,16.99) 32.83,16.99 C6.2
  Bottom Layer w0.762: RST.3 18.2,2.68 21.21,5.69 30.23,5.69 36.83,12.3 v1(36.83,16.99) ; v1(53.85,35.54) 55.63,33.76 v1(55.63,10.26) ; v1(26.16,44.43) 26.42,44.68 26.42,46.2 27.18,46.97 34.54,46.97 H1.1 ; CN1.5 3.47,42.5 v1(16.25,42.5) ; v1(46.48,20.3) 46.48,11.03 v1(47.5,10.01)
  vias: v1(10.29,16.99) v1(10.41,22.33) v1(10.54,19.66)
VDDA: length 12.2
  Top Layer w0.254: L1.2 48.58,24.01 C12.2 C11.2 43.98,24.11 41.4,24.11 39.1,26.41 U2.9
BOOT0: length 36.9
  Top Layer w0.254: CN1.1 3.28,32.31 R8.2 8.64,32.37 v1(8.64,33.76) ; U2.44 34.43,31.58 v1(35.18,30.84)
  Bottom Layer w0.254: v1(8.64,33.76) 21.59,33.76 24.51,30.84 v1(35.18,30.84)
KEY1: length 82.7
  Top Layer w0.254: U2.10 39.6,26.93 40.51,26.01 v1(50.42,26.01) 53.97,26.01 65.15,14.83 70.87,14.83 H2.34
  Bottom Layer w0.254: v1(50.42,26.01) 50.42,22.58 48.51,20.68 48.51,5.31 47.37,4.17 29.1,4.17 KEY1.3
KEY2: length 81.2
  Top Layer w0.254: v1(36.58,32.87) 36.58,36.56 U2.33 36.6,40.89 37.97,42.27 68.83,42.27 H2.13 ; R2.1 41.69,11.93 C4.2 41.69,9.82 KEY2.1
  Bottom Layer w0.254: v1(36.58,32.87) 43.18,26.27 43.18,13.56 44.58,12.17 44.58,9.37 42.38,7.18 KEY2.1
KEY3: length 96.7
  Top Layer w0.254: KEY3.1 50.82,7.09 52.07,7.09 52.57,7.59 C5.2 52.46,10.38 R3.1 ; v1(35.1,34.77) U2.36 35.1,41.93 37.08,43.92 66.29,43.92 67.69,45.31 70.87,45.31 H2.10
  Bottom Layer w0.254: v1(35.1,34.77) 38.86,34.77 40.39,33.25 50.8,33.25 52.71,31.34 52.71,14.83 50.72,12.86 KEY3.1
LED1: length 78.8
  Top Layer w0.254: H2.17 69.47,36.3 61.59,36.3 58.04,39.85 v1(48.51,39.85) 39.24,39.85 38.6,39.21 U2.29 ; R5.1 14.1,51.15 14.99,50.27 26.8,50.27 27.31,49.76 v1(27.31,45.57)
  Bottom Layer w0.254: v1(27.31,45.57) 30.23,42.65 46.86,42.65 48.51,41 v1(48.51,39.85)
LED2: length 90.8
  Top Layer w0.254: U2.46 31.24,30.58 27.94,33.89 v1(27.94,40.01) 27.94,53.44 31.24,56.75 H2.1 ; R6.1 v1(18.34,50.95)
  Bottom Layer w0.254: v1(27.94,40.01) 27.85,40.11 19.43,40.11 18.34,41.2 v1(18.34,50.95)
NRST: length 90.2
  Top Layer w0.254: v1(39.12,24.11) 38.1,25.13 U2.7 ; RST.1 17.96,9.47 C13.2 17.98,10.29 R7.1 7.75,12.04 5.97,13.82 5.97,27.41 8,29.44 9.27,29.44 9.91,30.08 9.91,33.5 8.83,34.58 CN1.2
  Bottom Layer w0.254: v1(39.12,24.11) 37.47,22.45 18.29,22.45 15.67,19.84 RST.1
OSC_IN: length 58.6
  Top Layer w0.254: 33.21,20.74 X1.1 31.43,20.43 C6.1 ; 33.21,20.74 37.1,24.63 U2.5 ; 33.21,20.74 34.6,20.74 34.93,20.42 v1(34.93,19.15) ; v1(42.04,18.14) 45.47,18.14 47.5,16.11 v1(59.18,16.11)
  Bottom Layer w0.254: H2.36 70.87,12.3 68.96,12.3 65.15,16.11 v1(59.18,16.11) ; v1(42.04,18.14) 41.02,19.15 v1(34.93,19.15)
OSC_OUT: length 44.9
  Top Layer w0.254: X1.2 37.6,23.16 U2.6 ; X1.2 40.01,17.63 C7.1 ; X1.2 44.64,20.74 48.26,17.12 v1(59.44,17.12)
  Bottom Layer w0.254: H2.35 66.04,17.12 v1(59.44,17.12)
PA1: length 35
  Top Layer w0.254: U2.11 40.1,27.21 40.4,26.9 54.36,26.9 65.15,16.11 H2.33
PA2: length 36.5
  Top Layer w0.254: U2.12 54.44,28.08 65.15,17.38 70.87,17.38 H2.32
PA3: length 32.1
  Top Layer w0.254: 42.13,29.62 U2.13 54.09,29.58 65.02,18.64 H2.31
PA4: length 34.8
  Top Layer w0.254: U2.14 54.47,30.08 64.64,19.92 70.87,19.92 H2.30
PA5: length 31.4
  Top Layer w0.254: U2.15 54.99,30.58 64.39,21.19 H2.29
PA6: length 34.4
  Top Layer w0.254: 68.47,22.45 64.13,22.45 55.51,31.08 U2.16 ; 68.47,22.45 68.71,22.45 ; 68.47,22.45 70.87,22.45 H2.28
PA7: length 30.8
  Top Layer w0.254: U2.17 55.9,31.58 63.75,23.72 H2.27
PA9: length 84.6
  Top Layer w0.254: U2.30 38.1,39.6 38.99,40.49 v1(47.12,40.49) 58.67,40.49 61.47,37.69 70.87,37.69 H2.16
  Bottom Layer w0.254: CN1.3 6.37,37.08 7.24,37.95 44.58,37.95 v1(47.12,40.49)
PA10: length 81.6
  Top Layer w0.254: H2.15 61.21,38.97 59.06,41.12 v1(46.1,41.12) 38.61,41.12 37.6,40.11 U2.31 ; v1(10.41,38.65) R9.2 7.77,39.58 CN1.4
  Bottom Layer w0.254: v1(46.1,41.12) 45.72,41.5 38.1,41.5 35.25,38.65 v1(10.41,38.65)
PA11: length 40.7
  Top Layer w0.254: U2.32 37.1,40.63 38.23,41.76 59.57,41.76 60.98,40.23 70.87,40.23 H2.14
PA13: length 41.8
  Top Layer w0.254: U2.34 36.1,41.15 37.76,42.81 70.91,42.81 H2.12
PA14: length 53.8
  Top Layer w0.254: U2.37 32.64,36.04 32.64,49.63 33.4,50.39 65.43,50.39 69.24,46.58 H2.9
PA15: length 62.2
  Top Layer w0.254: 33.27,51.16 v1(41.02,51.16) 65.53,51.16 68.83,47.86 70.87,47.86 H2.8 ; U2.38 32.45,34.58 31.88,35.16 31.88,49.76 33.15,51.03
  Bottom Layer w0.254: 41.02,48.11 v1(41.02,51.16)
PB0: length 33.8
  Top Layer w0.254: 68.71,25 63.5,25 56.41,32.08 U2.18 ; 68.71,25 70.87,25 H2.26 ; 68.71,25 68.41,25
PB1: length 30.2
  Top Layer w0.254: U2.19 56.93,32.58 63.37,26.14 69.47,26.14 H2.25
PB2: length 33.2
  Top Layer w0.254: 68.71,27.53 68.41,27.53 ; 68.41,27.53 62.99,27.53 57.44,33.08 U2.20 ; 68.41,27.53 70.87,27.53 H2.24
PB3: length 65
  Top Layer w0.254: U2.39 32.19,34.08 31.37,34.9 31.37,50.39 32.89,51.92 v1(42.42,51.92) 65.78,51.92 68.57,49.12 H2.7
  Bottom Layer w0.254: v1(42.42,51.92) 42.42,46.97 41.02,45.57
PB4: length 67.3
  Top Layer w0.254: H2.6 70.87,50.39 68.58,50.39 66.42,52.55 v1(43.56,52.55) 32.38,52.55 30.86,51.03 30.86,34.65 31.92,33.58 U2.40
  Bottom Layer w0.254: v1(43.56,52.55) H1.8
PB5: length 70.2
  Top Layer w0.254: U2.41 31.66,33.08 30.35,34.39 30.35,51.67 32,53.32 v1(45.34,53.32) 66.68,53.32 68.33,51.67 H2.5
  Bottom Layer w0.254: H1.7 45.34,47.35 v1(45.34,53.32)
PB6: length 73.5
  Top Layer w0.254: U2.42 31.41,32.58 29.72,34.28 29.72,52.05 31.88,54.2 v1(36.83,54.2) 66.68,54.2 67.94,52.94 70.87,52.94 H2.4
  Bottom Layer w0.254: v1(36.83,54.2) 38.48,52.55 H1.4
PB7: length 76.2
  Top Layer w0.254: H2.3 68.83,54.97 v1(37.21,54.97) 31.62,54.97 29.21,52.55 29.21,34.14 31.26,32.08 U2.43
  Bottom Layer w0.254: H1.3 39.62,46.71 39.62,52.55 v1(37.21,54.97)
PB8: length 70.2
  Top Layer w0.254: U2.45 31.5,31.08 28.57,34.01 28.57,52.81 31.37,55.6 70.99,55.6 H2.2
PB10: length 29.7
  Top Layer w0.254: U2.21 58.09,33.58 63.12,28.55 69.34,28.55 H2.23
PB11: length 32.2
  Top Layer w0.254: U2.22 58.47,34.08 62.48,30.08 70.87,30.08 H2.22
PB12: length 32.3
  Top Layer w0.254: H2.21 62.23,31.34 55.88,37.69 41.28,37.69 40.6,37.02 U2.25
PB13: length 36.2
  Top Layer w0.254: H2.20 70.87,32.61 62.1,32.61 56.51,38.2 40.64,38.2 40.1,37.66 U2.26
PB14: length 33.8
  Top Layer w0.254: U2.27 39.6,38.05 40.26,38.71 57.15,38.71 62.1,33.76 69.47,33.76 H2.19
PB15: length 37.4
  Top Layer w0.254: H2.18 70.87,35.16 61.72,35.16 57.66,39.22 39.88,39.22 39.1,38.44 U2.28
PC13: length 64.4
  Top Layer w0.254: U2.2 35.6,26.17 33.91,24.49 29.21,24.49 26.85,22.12 26.85,15.8 28.57,14.07 63.65,14.07 69.24,8.48 H2.39
PC14: length 66.1
  Top Layer w0.254: H2.38 70.87,9.75 68.71,9.75 63.75,14.71 29.08,14.71 27.43,16.36 27.43,21.95 29.46,23.98 34.29,23.98 36.1,25.78 U2.3
PC15: length 61.8
  Top Layer w0.254: U2.4 36.6,25.27 34.8,23.47 29.62,23.47 27.94,21.79 27.94,17.12 29.72,15.34 64,15.34 68.31,11.03 H2.37
PF6: length 40
  Top Layer w0.254: 67.38,44.05 66.75,43.41 ; 67.38,44.05 67.18,44.05 ; 67.38,44.05 H2.11 ; U2.35 35.6,41.54 37.47,43.41 66.55,43.41
$1N1197: length 2.9
  Top Layer w0.254: PWR_LED.1 R4.2
$1N1482: length 5.9
  Top Layer w0.254: R1.1 30.11,9.68 KEY1.1
$1N2236: length 3
  Top Layer w0.254: R5.2 14.26,53.98 LED1.1
$1N2239: length 2.9
  Top Layer w0.254: R6.2 18.34,56.6 LED2.1

## Copper pours and planes (outline as drawn; the poured copper is in the pictures)
GND on Top Layer: -1.65,66.27 76.2,66.27 76.2,-1.42 -1.65,-1.42
GND on Bottom Layer: -1.91,66.14 76.71,66.14 76.71,-1.55 -1.91,-1.55

Small or netless copper shapes (teardrops, artwork), in the pictures only: 245 on Top Layer, 40 on Bottom Layer

## Text on the board
Top Silkscreen Layer: OSC_OUT | OSC_IN | 5V | GND | UORX | UOTX | NRST | BOOT0 | PB7 | PB6 | PA15 | PB3 | PB4 | PB5 | KEY2 | LED2 | PA14 | LED1 | PA10 | PB14 | PC15 | PC13 | PB12 | PA7 | PA5 | PA3 | PF6 | PB10 | PB1 | PA1 | KEY3 | PC14 | PA13 | KEY1 | PB15 | PB13 | PA11 | PB11 | PA4 | PA2 | PA9 | PA6 | PB8 | PB2 | PB0
